# EAGLE design Arduino Basic Sensor Board (EAGLE 7.5.0)
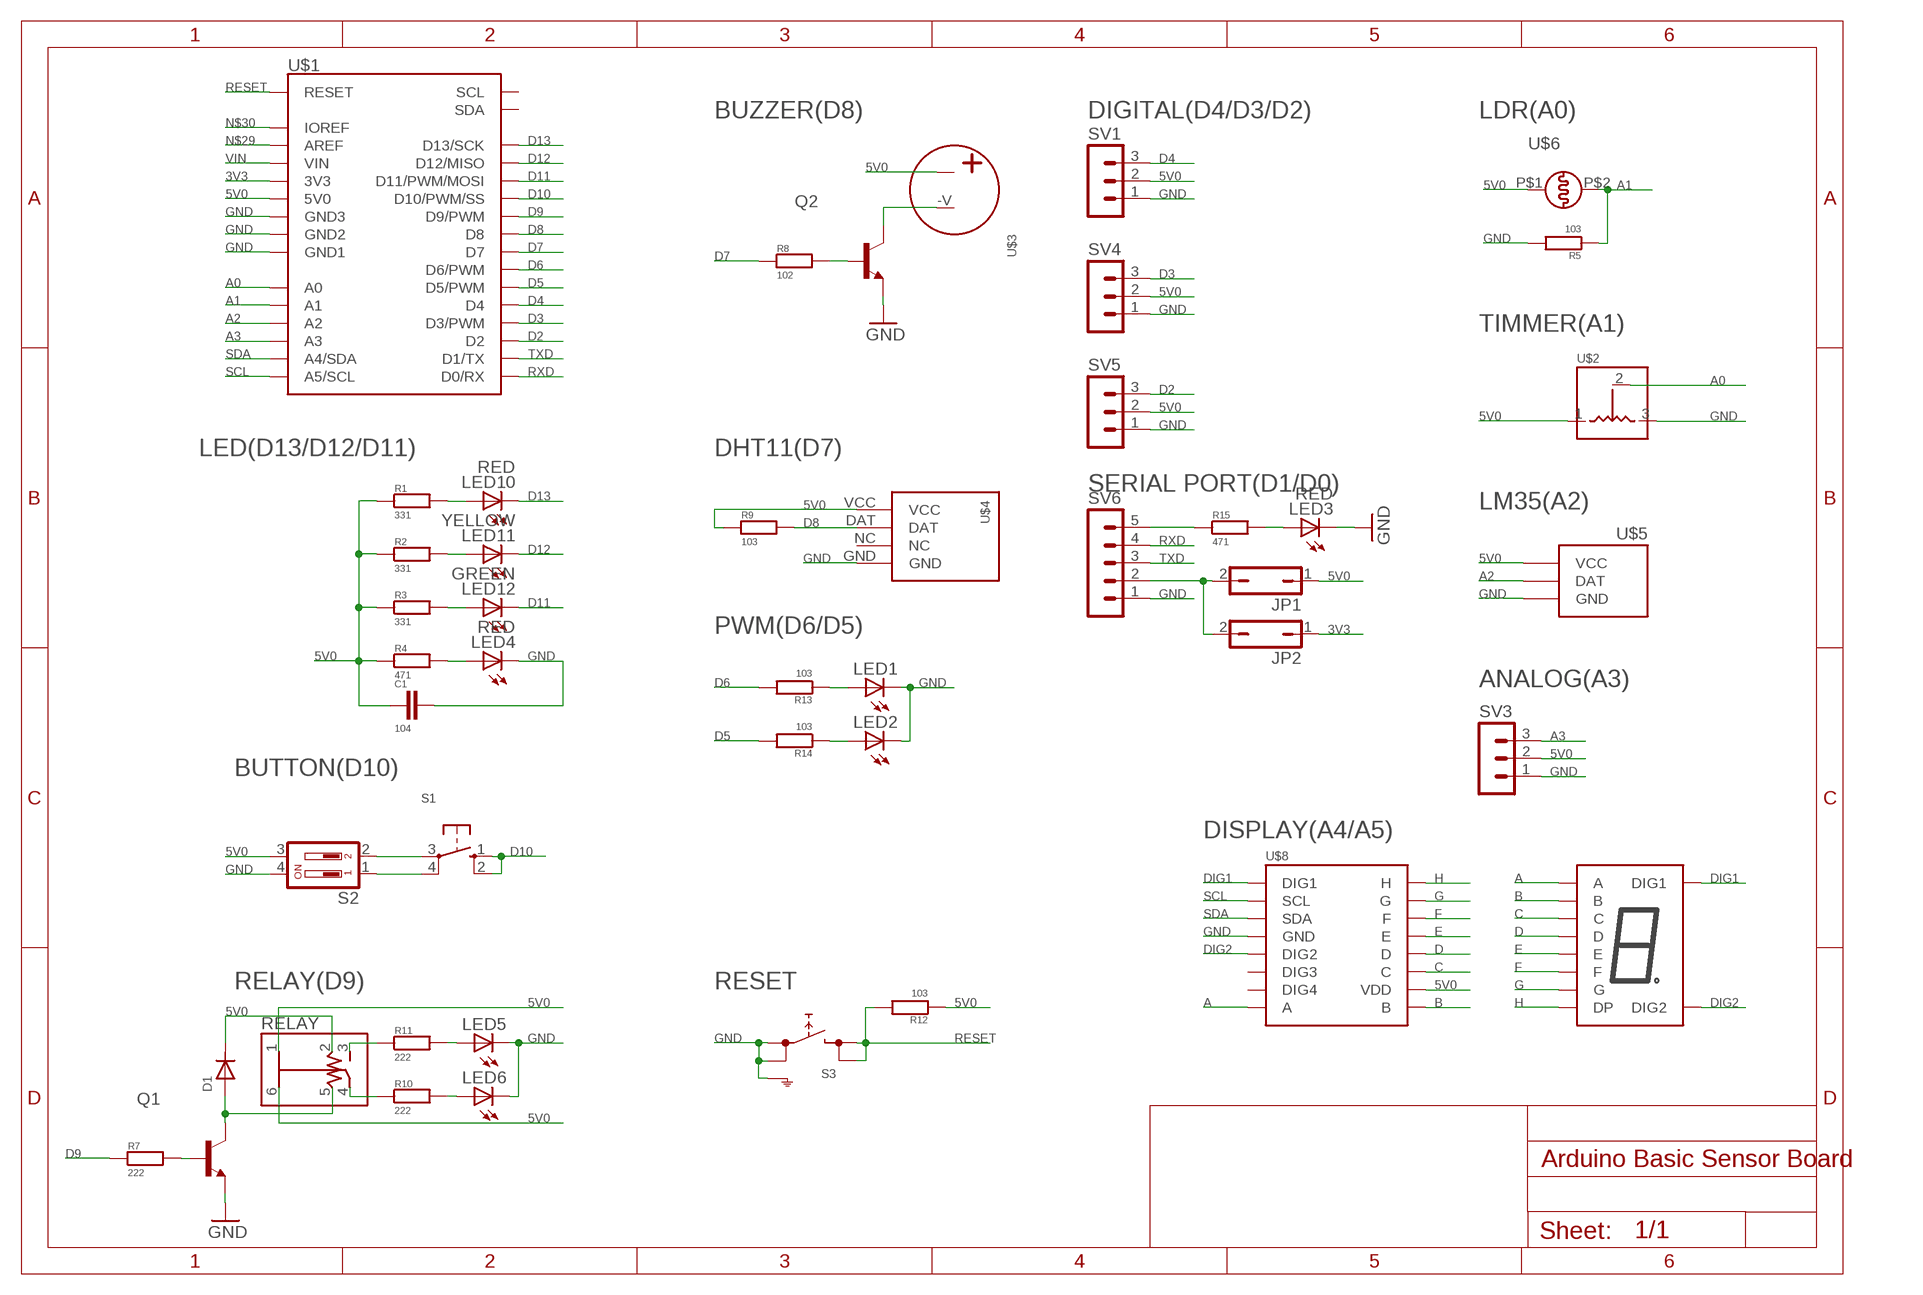
[diagram p0: schematic, sheet 1]

## Parts
C1  104  C0805  [C0805]
D1  DIODESMB  [SMB]
JP1  JP1Q  [JP1Q]
JP2  JP1Q  [JP1Q]
LED1  LEDCHIPLED_1206  [LED1206]
LED2  LEDCHIPLED_1206  [LED1206]
LED3  RED  LEDCHIPLED_0805  [LED0805]
LED4  RED  LEDCHIPLED_0805  [LED0805]
LED5  LEDSML1206  [SML1206]
LED6  LEDSML1206  [SML1206]
LED10  RED  LEDSML1206  [SML1206]
LED11  YELLOW  LEDSML1206  [SML1206]
LED12  GREEN  LEDSML1206  [SML1206]
Q1  S8050SOT23  [SOT23]
Q2  S8050SOT23  [SOT23]
R1  331  R0805  [R0805]
R2  331  R0805  [R0805]
R3  331  R0805  [R0805]
R4  471  R0805  [R0805]
R5  103  R0805  [R0805]
R7  222  R0805  [R0805]
R8  102  R0805  [R0805]
R9  103  R0805  [R0805]
R10  222  R0805  [R0805]
R11  222  R0805  [R0805]
R12  103  R0805  [R0805]
R13  103  R0805  [R0805]
R14  103  R0805  [R0805]
R15  471  R0805  [R0805]
RELAY  RELAY-HK4100F-DC5V  [RELAY-HK4100F-DC5V]
S1  TS-DIP-4.54.5  [TS-DIP-4.5*4.5]
S2  SD4-02  [SD4-02]
S3  TS-SMD_6S6_SHIELD  [TS-SMD_6*6_SHIELD]
SV1  MA03-1  [MA03-1]
SV3  MA03-1  [MA03-1]
SV4  MA03-1  [MA03-1]
SV5  MA03-1  [MA03-1]
SV6  MA05-1  [MA05-1]
U$1  ARDUINO-UNO  [ARDUINO-UNO]
U$2  33623362  [3362]
U$3  BUZZER  [BUZZER]
U$4  DHT11  [DHT11]
U$5  LM35  [TO92]
U$6  LDR  [LDR]
U$8  TM1650  [SOP16]
U$15  3261AS  [TN_AS_2_0.36INCH]

## Nets
3V3: JP2.1 U$1.3V3
5V0: C1.2 D1.1 JP1.1 R1.1 R2.1 R3.1 R4.1 R9.1 R12.1 RELAY.1 RELAY.2 RELAY.6 S2.3 SV1.2 SV3.2 SV4.2 SV5.2 U$1.5V0 U$2.1 U$3.+V U$4.VCC U$5.1(VCC) U$6.P$1 U$8.10(VDD)
A: U$8.8(A) U$15.3(A)
A0: U$1.A0 U$2.2
A1: R5.1 U$1.A1 U$6.P$2
A2: U$1.A2 U$5.2(DAT)
A3: SV3.3 U$1.A3
B: U$8.9(B) U$15.9(B)
C: U$8.11(C) U$15.8(C)
D: U$8.12(D) U$15.6(D)
D2: SV5.3 U$1.D2
D3: SV4.3 U$1.D3(D3/PWM)
D4: SV1.3 U$1.D4
D5: R14.2 U$1.D5(D5/PWM)
D6: R13.2 U$1.D6(D6/PWM)
D7: R8.1 U$1.D7
D8: R9.2 U$1.D8 U$4.DAT
D9: R7.1 U$1.D9(D9/PWM)
D10: S1.1(S) S1.2(S1) U$1.D10(D10/PWM/SS)
D11: LED12.C U$1.D11(D11/PWM/MOSI)
D12: LED11.C U$1.D12(D12/MISO)
D13: LED10.C U$1.D13(D13/SCK)
DIG1: U$8.1(DIG1) U$15.10(DIG1)
DIG2: U$8.5(DIG2) U$15.5(DIG2)
E: U$8.13(E) U$15.7(E)
F: U$8.14(F) U$15.4(F)
G: U$8.15(G) U$15.1(G)
GND: C1.1 LED1.C LED2.C LED3.C LED4.C LED5.C LED6.C Q1.E Q2.E R5.2 S2.4 S3.1(1.1) S3.2(1.2) S3.5(SH) SV1.1 SV3.1 SV4.1 SV5.1 SV6.1 U$1.GND1 U$1.GND2 U$1.GND3 U$2.3 U$4.GND U$5.3(GND) U$8.4(GND)
H: U$8.16(H) U$15.2(DP)
N$1: LED10.A R1.2
N$2: LED11.A R2.2
N$3: LED12.A R3.2
N$4: LED4.A R4.2
N$5: S1.4(P1) S2.1
N$6: S1.3(P) S2.2
N$7: LED1.A R13.1
N$8: R10.1 RELAY.4
N$9: R11.1 RELAY.3
N$10: LED6.A R10.2
N$11: LED5.A R11.2
N$12: LED2.A R14.1
N$13: JP1.2 JP2.2 SV6.2
N$14: R15.1 SV6.5
N$15: LED3.A R15.2
N$29: U$1.AREF
N$30: U$1.REF(IOREF)
N$32: D1.2 Q1.C RELAY.5
N$33: Q1.B R7.2
N$34: Q2.B R8.2
N$35: Q2.C U$3.-V
RESET: R12.2 S3.3(2.1) S3.4(2.2) U$1.RST(RESET)
RXD: SV6.4 U$1.D0(D0/RX)
SCL: U$1.A5(A5/SCL) U$8.2(SCL)
SDA: U$1.A4(A4/SDA) U$8.3(SDA)
TXD: SV6.3 U$1.D1(D1/TX)
VIN: U$1.VIN
Unconnected: U$1.SCL U$1.SDA U$4.NC U$8.6(DIG3) U$8.7(DIG4)

## Notes on the sheet
- BUZZER(D8) | DIGITAL(D4/D3/D2) | LDR(A0)
- TIMMER(A1)
- LED(D13/D12/D11) | DHT11(D7)
- SERIAL PORT(D1/D0)
- LM35(A2)
- PWM(D6/D5)
- ANALOG(A3)
- BUTTON(D10)
- DISPLAY(A4/A5)
- RELAY(D9) | RESET

## Library data of the parts
C1 = RCLDA:C: CAPACITOR
D1 = RCLDA:DIODE: DIODE
JP1 JP2 = Jumper:JP1Q: JUMPER
LED1-LED6 LED10-LED12 = Display:LED
Q1 Q2 = RCLDA:S8050: NPN Transistor
R1-R5 R7-R15 = RCLDA:R: RESISTOR
RELAY = Senser:RELAY-HK4100F-DC5V
S1 = Button:TS-DIP-4.5*4.5: OMRON SWITCH; MPN: B3F-1000; OC_FARNELL: 176432; OC_NEWARK: 36M3542
S2 = Switch:SD4-02: DIL/CODE SWITCH; OC_FARNELL: unknown; OC_NEWARK: unknown
S3 = Button:TS-SMD_6*6_SHIELD: 6.2 X 6.5mm TACT Switch (SMD) Source: http://www3.alps.co.jp/WebObjects/catalog.woa/PDF/E/Switch/Tact/SKHM/SKHM.PDF
SV1 SV3-SV5 = Pin-Header:MA03-1: PIN HEADER; OC_FARNELL: unknown; OC_NEWARK: unknown
SV6 = Pin-Header:MA05-1: PIN HEADER; OC_FARNELL: unknown; OC_NEWARK: unknown
U$1 = Module:ARDUINO-UNO
U$2 = Senser:3362
U$3 = Senser:BUZZER
U$4 = Senser:DHT11
U$5 = Senser:LM35
U$6 = Senser:LDR
U$8 = Chip:TM1650
U$15 = Display:3261AS

## Board
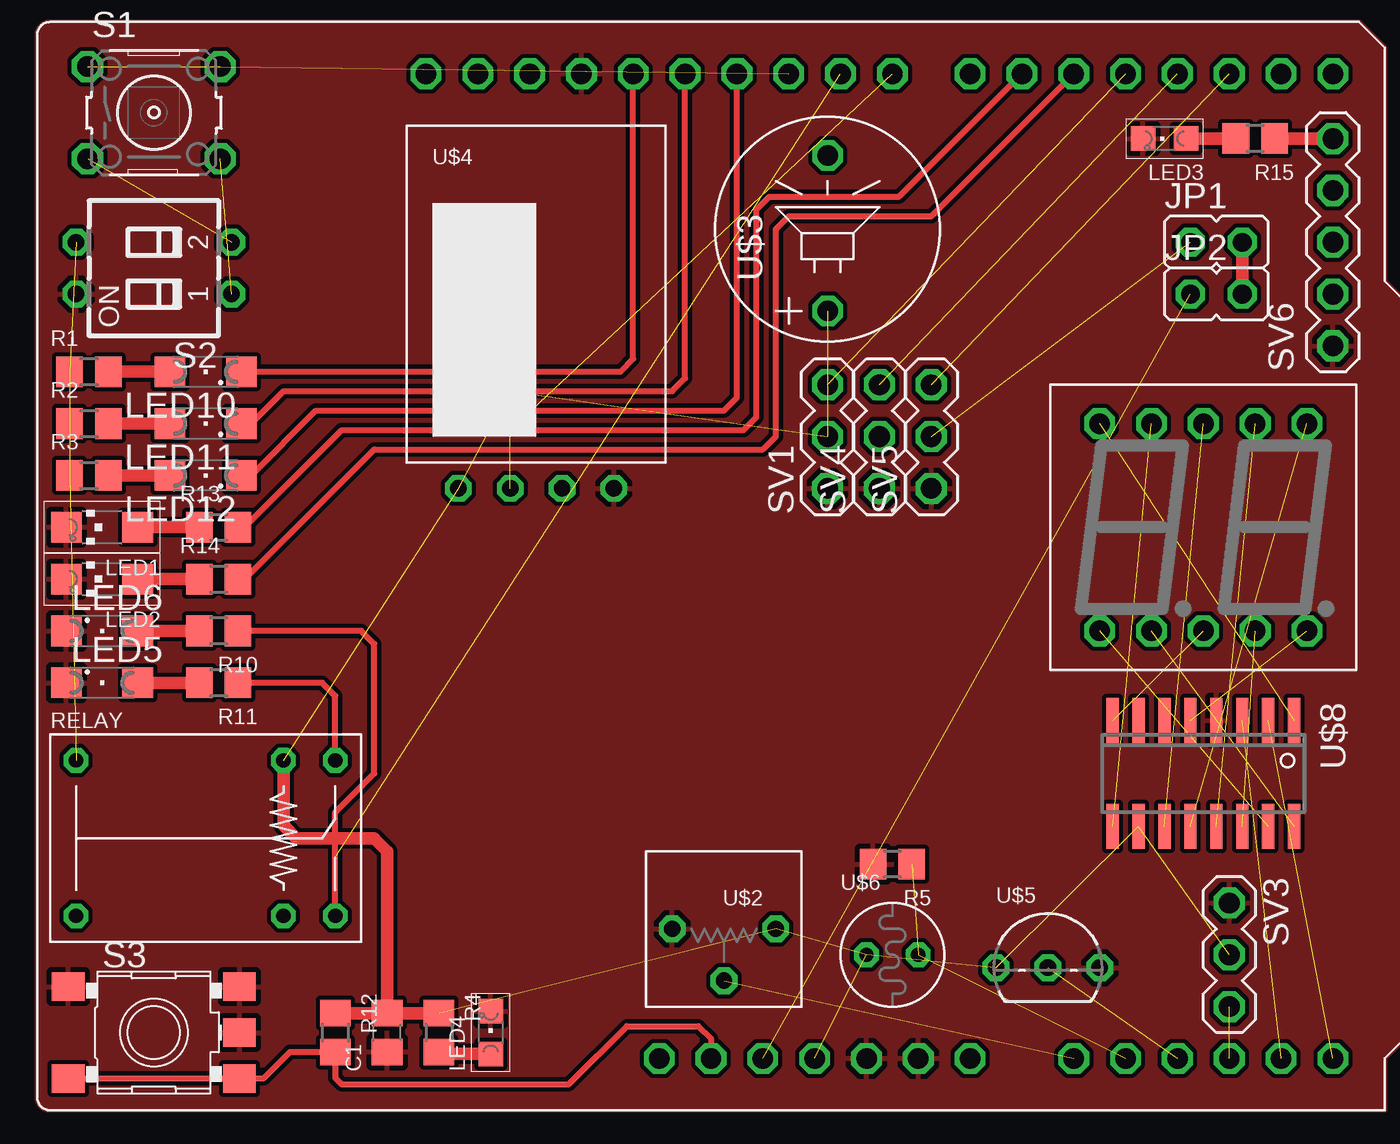
[diagram p1: board, top side]
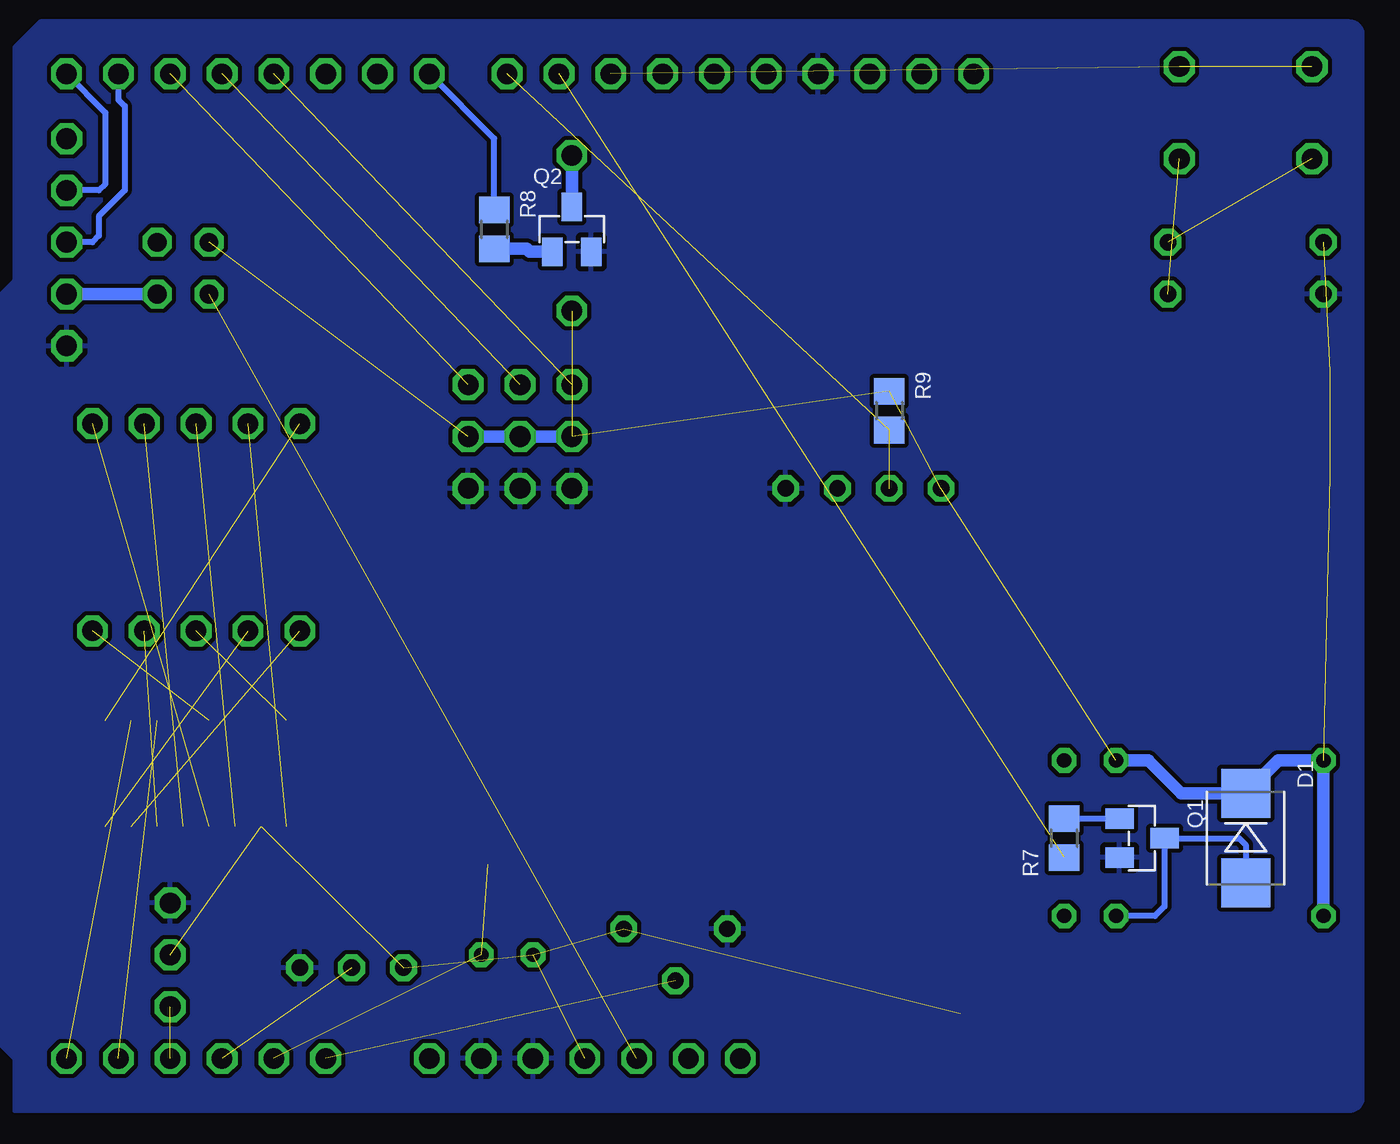
[diagram p2: board, bottom side, seen from below]

No outline drawn. Coordinates in mm, seen from the top.
Copper layers (1*16): Top 0.035mm / dielectric 1.5mm / Bottom 0.035mm
Design rules "default": minimum track width 10mil, minimum drill 24mil, track to track 8mil, track to pad 8mil, pad to pad 8mil, via to via 8mil, smd to smd 8mil, copper to edge 40mil, drill to drill 8mil, minimum pad ring 10mil, minimum via ring 8mil, stop-mask expansion 4mil, vias tented up to drill 0mil, thermal gap 10mil

### Footprints (pad centres in the part's own frame; a part is rotated, then mirrored left to right if it is on the bottom)
C0805 = smd 1.3 x 1.5: 1 -0.95,0; 2 0.95,0
SMB = smd 2.4 x 2.4: 1 -2.2,0; 2 2.2,0
JP1Q = drill 0.914 octagon: 1 0,-1.27; 2 0,1.27
LED1206 = smd 1.5 x 1.5: A -1.75,0; C 1.75,0
LED0805 = smd 1.2 x 1.2: A -1.05,0; C 1.05,0
SML1206 = smd 1.5 x 1.5: A 1.75,0; C -1.75,0
SOT23 = smd 1 x 1.4: B -0.95,-1.1; C 0,1.1; E 0.95,-1.1
R0805 = smd 1.3 x 1.5: 1 -0.95,0; 2 0.95,0
RELAY-HK4100F-DC5V = drill 0.7 octagon: 1 -6.35,3.81; 2 3.81,3.81; 3 6.35,3.81; 4 6.35,-3.81; 5 3.81,-3.81; 6 -6.35,-3.81
TS-DIP-4.5*4.5 = drill 1.016 octagon: 1 -3.251,2.261; 2 3.251,2.261; 3 -3.251,-2.261; 4 3.251,-2.261
SD4-02 = drill 0.813 octagon: 1 -1.27,-3.81; 2 1.27,-3.81; 3 1.27,3.81; 4 -1.27,3.81
TS-SMD_6*6_SHIELD = smd 1.6 x 1.4: 1 -4.2,2.25; 2 4.2,2.25; 3 -4.2,-2.25; 4 4.2,-2.25; 5 4.2,0
MA03-1 = drill 1.016 octagon: 1 -2.54,0; 2 0,0; 3 2.54,0
MA05-1 = drill 1.016 octagon: 1 -5.08,0; 2 -2.54,0; 3 0,0; 4 2.54,0; 5 5.08,0
ARDUINO-UNO = drill 1 octagon: 3V3 35.56,2.54; 5V0 38.1,2.54; A0 50.8,2.54; A1 53.34,2.54; A2 55.88,2.54; A3 58.42,2.54; A4 60.96,2.54; A5 63.5,2.54; AREF 24.13,50.8; D0 63.5,50.8; D1 60.96,50.8; D2 58.42,50.8; D3 55.88,50.8; D4 53.34,50.8; D5 50.8,50.8; D6 48.26,50.8; D7 45.72,50.8; D8 41.91,50.8; D9 39.37,50.8; D10 36.83,50.8; D11 34.29,50.8; D12 31.75,50.8; D13 29.21,50.8; GND1 26.67,50.8; GND2 43.18,2.54; GND3 40.64,2.54; REF 30.48,2.54; RST 33.02,2.54; SCL 19.05,50.8; SDA 21.59,50.8; VIN 45.72,2.54
3362 = drill 0.8 octagon: 1 -2.54,0; 2 0,2.54; 3 2.54,0
BUZZER = drill 1 octagon: +V -4,0; -V 3.62,0
DHT11 = drill 0.8 octagon: DAT -1.27,-10.16; GND 3.81,-10.16; NC 1.27,-10.16; VCC -3.81,-10.16
TO92 = drill 0.813 octagon: 1 -2.54,0; 2 0,0; 3 2.54,0
LDR = drill 0.7 octagon: P$1 0,0; P$2 2.54,0
SOP16 = smd 0.6 x 2.2: 1 -4.445,-2.6; 2 -3.175,-2.6; 3 -1.905,-2.6; 4 -0.635,-2.6; 5 0.635,-2.6; 6 1.905,-2.6; 7 3.175,-2.6; 8 4.445,-2.6; 9 4.445,2.6; 10 3.175,2.6; 11 1.905,2.6; 12 0.635,2.6; 13 -0.635,2.6; 14 -1.905,2.6; 15 -3.175,2.6; 16 -4.445,2.6
TN_AS_2_0.36INCH = drill 1 octagon: 1 -5.08,-5.08; 2 -2.54,-5.08; 3 0,-5.08; 4 2.54,-5.08; 5 5.08,-5.08; 6 5.08,5.08; 7 2.54,5.08; 8 0,5.08; 9 -2.54,5.08; 10 -5.08,5.08

### Placement (x,y rotation side)
C1  17.14,3.81 90 top
D1  5.71,13.34 270 bottom
JP1  57.78,42.55 270 top
JP2  57.78,40.01 270 top
LED1  3.17,28.57 180 top
LED2  3.17,26.04 180 top
LED3  55.24,47.62 180 top
LED4  22.23,3.81 90 top
LED5  3.17,20.95 0 top
LED6  3.17,23.5 0 top
LED10  8.26,36.2 180 top
LED11  8.26,33.66 180 top
LED12  8.26,31.11 180 top
Q1  10.79,13.34 270 bottom
Q2  38.73,43.18 0 bottom
R1  2.54,36.2 0 top
R2  2.54,33.66 0 top
R3  2.54,31.11 0 top
R4  19.68,3.81 270 top
R5  41.91,12.06 180 top
R7  14.61,13.34 90 bottom
R8  42.55,43.18 270 bottom
R9  23.18,34.29 270 bottom
R10  8.89,23.5 180 top
R11  8.89,20.95 180 top
R12  14.61,3.81 270 top
R13  8.89,28.57 0 top
R14  8.89,26.04 0 top
R15  59.69,47.62 180 top
RELAY  8.26,13.34 0 top
S1  5.71,48.9 0 top
S2  5.71,41.27 90 top
S3  5.71,3.81 0 top
SV1  38.73,33.02 90 top
SV3  58.42,7.62 270 top
SV4  41.27,33.02 90 top
SV5  43.81,33.02 90 top
SV6  63.5,42.55 90 top
U$1  0,0 0 top
U$2  33.66,8.89 180 top
U$3  38.73,43.18 90 top
U$4  24.45,40.64 0 top
U$5  49.53,6.99 0 top
U$6  40.64,7.62 0 top
U$8  57.15,16.51 180 top
U$15  57.15,28.57 0 top

### Tracks (layer width: path | path; a pad name or v marks a point on that pad's centre or on a via)
3V3  (1 unrouted)
5V0  (15 unrouted)
  Top 0.61: R12.1 C1.2 | C1.2 R4.1 | RELAY.2 12.06,13.97 12.7,13.34 16.51,13.34 17.14,12.7 C1.2
  Bottom 0.61: SV1.2 SV4.2 SV5.2 | RELAY.6 RELAY.1 4.11,17.14 D1.1 8.87,15.54 10.48,17.14 RELAY.2
A  (1 unrouted)
A0  (1 unrouted)
A1  (2 unrouted)
A2  (1 unrouted)
A3  (1 unrouted)
B  (1 unrouted)
C  (1 unrouted)
D  (1 unrouted)
D2  (1 unrouted)
D3  (1 unrouted)
D4  (1 unrouted)
D5
  Top 0.305: R14.2 10.16,26.04 16.51,32.38 35.56,32.38 36.2,33.02 36.2,43.18 36.83,43.81 43.81,43.81 U$1.D5
D6
  Top 0.305: R13.2 10.16,28.57 14.92,33.34 34.61,33.34 35.24,33.97 35.24,44.13 35.88,44.77 42.23,44.77 U$1.D6
D7
  Bottom 0.305: R8.1 42.55,47.62 U$1.D7
D8  (2 unrouted)
D9  (1 unrouted)
D10  (2 unrouted)
D11
  Top 0.305: LED12.C 10.48,31.11 13.65,34.29 33.66,34.29 34.29,34.92 U$1.D11
D12
  Top 0.305: LED11.C 10.48,33.66 12.06,35.24 31.11,35.24 31.75,35.88 U$1.D12
D13
  Top 0.305: LED10.C 28.57,36.2 29.21,36.83 U$1.D13
DIG1  (1 unrouted)
DIG2  (1 unrouted)
E  (1 unrouted)
F  (1 unrouted)
G  (1 unrouted)
GND
  pour Top: 0,0.64 0,52.7 arc-90 0.64,53.34 64.77,53.34 66.04,52.07 66.04,40.64 68.58,38.1 68.58,5.08 66.04,2.54 66.04,0 0.64,0 arc-90
  pour Bottom: 0,0.64 0,52.7 arc-90 0.64,53.34 64.77,53.34 66.04,52.07 66.04,40.64 68.58,38.1 68.58,5.08 66.04,2.54 66.04,0 0.64,0 arc-90
H  (1 unrouted)
N$1
  Top 0.61: R1.2 LED10.A
N$2
  Top 0.61: R2.2 LED11.A
N$3
  Top 0.61: R3.2 LED12.A
N$4
  Top 0.61: LED4.A 19.79,2.76 R4.2
N$5  (1 unrouted)
N$6  (1 unrouted)
N$7
  Top 0.61: R13.1 LED1.A
N$8
  Top 0.305: RELAY.4 14.61,14.61 16.51,16.51 16.51,22.86 15.88,23.5 R10.1
N$9
  Top 0.305: RELAY.3 14.61,20.32 13.97,20.95 R11.1
N$10
  Top 0.61: R10.2 LED6.A
N$11
  Top 0.61: R11.2 LED5.A
N$12
  Top 0.61: R14.1 LED2.A
N$13
  Top 0.61: JP1.2 JP2.2
  Bottom 0.61: JP2.2 SV6.2
N$14
  Top 0.61: SV6.5 R15.1
N$15
  Top 0.61: R15.2 LED3.A
N$32
  Bottom 0.305: D1.2 5.71,13.02 6.03,13.34 Q1.C 9.7,9.99 10.16,9.53 RELAY.5
N$33
  Bottom 0.305: Q1.B R7.2
N$34
  Bottom 0.61: Q2.B 40.81,42.08 40.96,42.23 R8.2
N$35
  Bottom 0.61: U$3.-V Q2.C
RESET
  Top 0.305: S3.3 S3.4 11.09,1.56 12.38,2.86 R12.2 14.61,1.59 14.92,1.27 26.04,1.27 28.89,4.13 32.38,4.13 33.02,3.49 U$1.RST
RXD
  Bottom 0.305: U$1.D0 61.59,48.9 61.59,45.4 61.91,45.09 SV6.4
SCL  (1 unrouted)
SDA  (1 unrouted)
TXD
  Bottom 0.305: U$1.D1 60.96,49.53 60.64,49.21 60.64,45.09 61.91,43.81 61.91,42.86 62.23,42.55 SV6.3